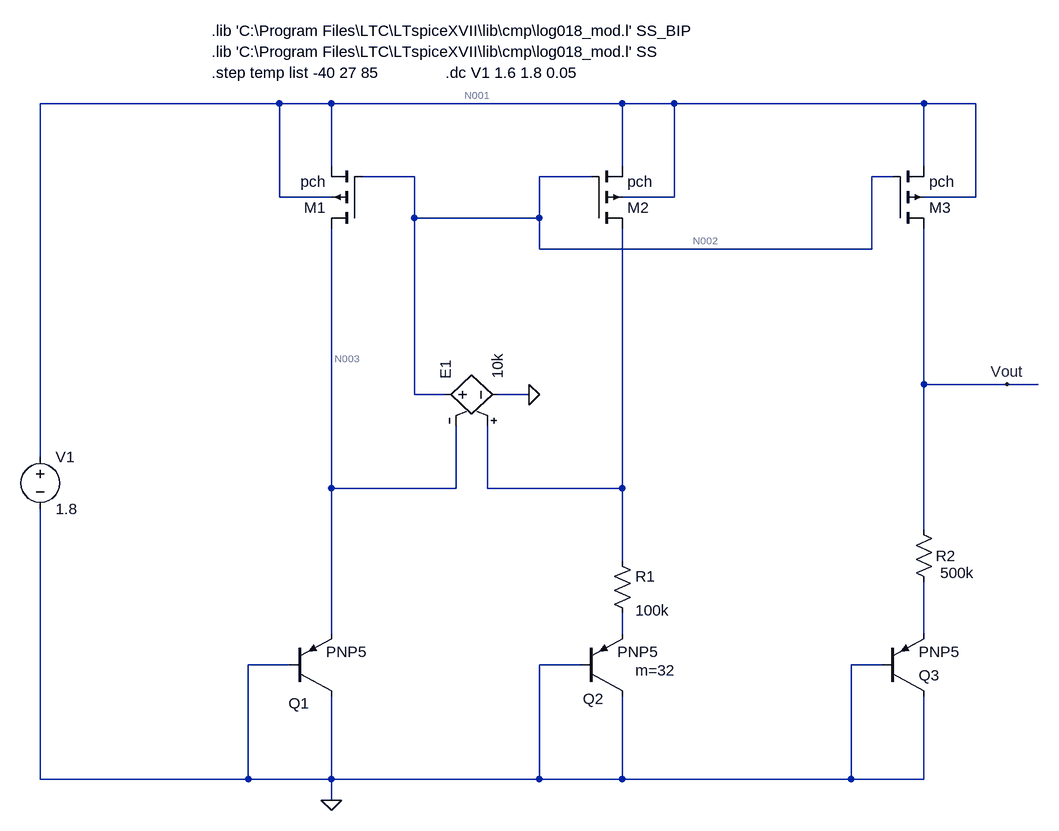
[diagram p0: schematic HW_Bandgap.asc]
HW_Bandgap.asc, the LTspice schematic file:
Version 4
SHEET 1 2248 1144
WIRE 320 -432 -48 -432
WIRE 400 -432 320 -432
WIRE 848 -432 400 -432
WIRE 928 -432 848 -432
WIRE 1312 -432 928 -432
WIRE 1392 -432 1312 -432
WIRE 400 -336 400 -432
WIRE 848 -336 848 -432
WIRE 1312 -336 1312 -432
WIRE 528 -320 448 -320
WIRE 800 -320 720 -320
WIRE 1264 -320 1232 -320
WIRE 320 -288 320 -432
WIRE 400 -288 320 -288
WIRE 928 -288 928 -432
WIRE 928 -288 848 -288
WIRE 1392 -288 1392 -432
WIRE 1392 -288 1312 -288
WIRE 528 -256 528 -320
WIRE 720 -256 720 -320
WIRE 720 -256 528 -256
WIRE 720 -208 720 -256
WIRE 1232 -208 1232 -320
WIRE 1232 -208 720 -208
WIRE 1312 0 1312 -240
WIRE 1440 0 1312 0
WIRE 1488 0 1440 0
WIRE 528 16 528 -256
WIRE 576 16 528 16
WIRE 704 16 656 16
WIRE -48 112 -48 -432
WIRE 400 160 400 -240
WIRE 592 160 592 64
WIRE 592 160 400 160
WIRE 640 160 640 64
WIRE 848 160 848 -240
WIRE 848 160 640 160
WIRE 1312 224 1312 0
WIRE 848 272 848 160
WIRE 400 384 400 160
WIRE 848 384 848 352
WIRE 1312 384 1312 304
WIRE 336 432 272 432
WIRE 784 432 720 432
WIRE 1248 432 1200 432
WIRE -48 608 -48 192
WIRE 272 608 272 432
WIRE 272 608 -48 608
WIRE 400 608 400 480
WIRE 400 608 272 608
WIRE 720 608 720 432
WIRE 720 608 400 608
WIRE 848 608 848 480
WIRE 848 608 720 608
WIRE 1200 608 1200 432
WIRE 1200 608 848 608
WIRE 1312 608 1312 480
WIRE 1312 608 1200 608
WIRE 400 640 400 608
FLAG 400 640 0
FLAG 704 16 0
FLAG 1440 0 Vout
SYMBOL pnp2 336 480 M180
WINDOW 0 -2 -11 Left 2
SYMATTR InstName Q1
SYMATTR Value PNP5
SYMBOL pnp2 784 480 M180
WINDOW 123 84 40 Left 2
WINDOW 0 3 -4 Left 2
SYMATTR Value2 m=32
SYMATTR InstName Q2
SYMATTR Value PNP5
SYMBOL voltage -48 96 R0
WINDOW 123 0 0 Left 0
WINDOW 39 0 0 Left 0
SYMATTR InstName V1
SYMATTR Value 1.8
SYMBOL pmos4 448 -240 R180
SYMATTR InstName M1
SYMATTR Value pch
SYMATTR Value2 l=500n w=2u
SYMBOL pmos4 800 -240 M180
SYMATTR InstName M2
SYMATTR Value pch
SYMATTR Value2 l=500n w=2u
SYMBOL e2 560 16 R270
SYMATTR InstName E1
SYMATTR Value 10k
SYMBOL res 832 256 R0
WINDOW 3 36 92 Left 2
SYMATTR Value 100k
SYMATTR InstName R1
SYMBOL pmos4 1264 -240 M180
SYMATTR InstName M3
SYMATTR Value pch
SYMATTR Value2 l=500n w=2u
SYMBOL res 1296 208 R0
WINDOW 0 34 56 Left 2
WINDOW 3 41 82 Left 2
SYMATTR InstName R2
SYMATTR Value 500k
SYMBOL pnp2 1248 480 M180
SYMATTR InstName Q3
SYMATTR Value PNP5
TEXT 216 -480 Left 2 !.step temp list -40 27 85
TEXT 216 -512 Left 2 !.lib 'C:\\Program Files\\LTC\\LTspiceXVII\\lib\\cmp\\log018_mod.l' SS
TEXT 216 -544 Left 2 !.lib 'C:\\Program Files\\LTC\\LTspiceXVII\\lib\\cmp\\log018_mod.l' SS_BIP
TEXT 576 -480 Left 2 !.dc V1 1.6 1.8 0.05

The netlist it stands for:
* HW_Bandgap.asc
Q1 0 0 N003 0 PNP5
Q2 0 0 N005 0 PNP5 m=32
V1 N001 0 1.8
M1 N003 N002 N001 N001 pch l=500n w=2u
M2 N004 N002 N001 N001 pch l=500n w=2u
E1 N002 0 N004 N003 10k
R1 N004 N005 100k
M3 Vout N002 N001 N001 pch l=500n w=2u
R2 Vout N006 500k
Q3 0 0 N006 0 PNP5
.model NPN NPN
.model PNP PNP
.lib standard.bjt
.model NMOS NMOS
.model PMOS PMOS
.lib standard.mos
.step temp list -40 27 85
.lib 'C:\Program Files\LTC\LTspiceXVII\lib\cmp\log018_mod.l' SS
.lib 'C:\Program Files\LTC\LTspiceXVII\lib\cmp\log018_mod.l' SS_BIP
.dc V1 1.6 1.8 0.05
.backanno
.end

* Results of the author's LTspice run, read from the files saved beside the schematic
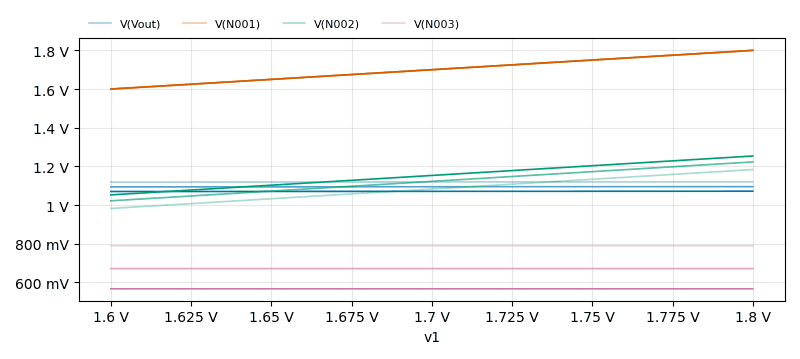
[diagram p1: DC transfer characteristic of HW_Bandgap.asc, plotted from the saved traces]
* DC transfer characteristic, 3 runs:
*   V(Vout) [temp=-40°C]: 1.119 V at v1=1.6 V, 1.12 V at v1=1.8 V, min 1.119 V, max 1.12 V
*   V(Vout) [temp=27°C]: 1.094 V at v1=1.6 V, 1.095 V at v1=1.8 V, min 1.094 V, max 1.095 V
*   V(Vout) [temp=85°C]: 1.07 V at v1=1.6 V, 1.072 V at v1=1.8 V, min 1.07 V, max 1.072 V
*   V(N001) [temp=-40°C]: 1.6 V at v1=1.6 V, 1.8 V at v1=1.8 V, min 1.6 V, max 1.8 V
*   V(N001) [temp=27°C]: 1.6 V at v1=1.6 V, 1.8 V at v1=1.8 V, min 1.6 V, max 1.8 V
*   V(N001) [temp=85°C]: 1.6 V at v1=1.6 V, 1.8 V at v1=1.8 V, min 1.6 V, max 1.8 V
*   V(N002) [temp=-40°C]: 982.5 mV at v1=1.6 V, 1.184 V at v1=1.8 V, min 982.5 mV, max 1.184 V
*   V(N002) [temp=27°C]: 1.022 V at v1=1.6 V, 1.223 V at v1=1.8 V, min 1.022 V, max 1.223 V
*   V(N002) [temp=85°C]: 1.053 V at v1=1.6 V, 1.254 V at v1=1.8 V, min 1.053 V, max 1.254 V
*   V(N003) [temp=-40°C]: 789.8 mV at v1=1.6 V, 789.8 mV at v1=1.8 V, min 789.8 mV, max 789.8 mV
*   V(N003) [temp=27°C]: 671.6 mV at v1=1.6 V, 671.6 mV at v1=1.8 V, min 671.6 mV, max 671.6 mV
*   V(N003) [temp=85°C]: 567.2 mV at v1=1.6 V, 567.2 mV at v1=1.8 V, min 567.2 mV, max 567.2 mV